# Altium schematic sheet WIFI_NVME.SchDoc
size B; SheetNumber: 10; SheetTotal: 11
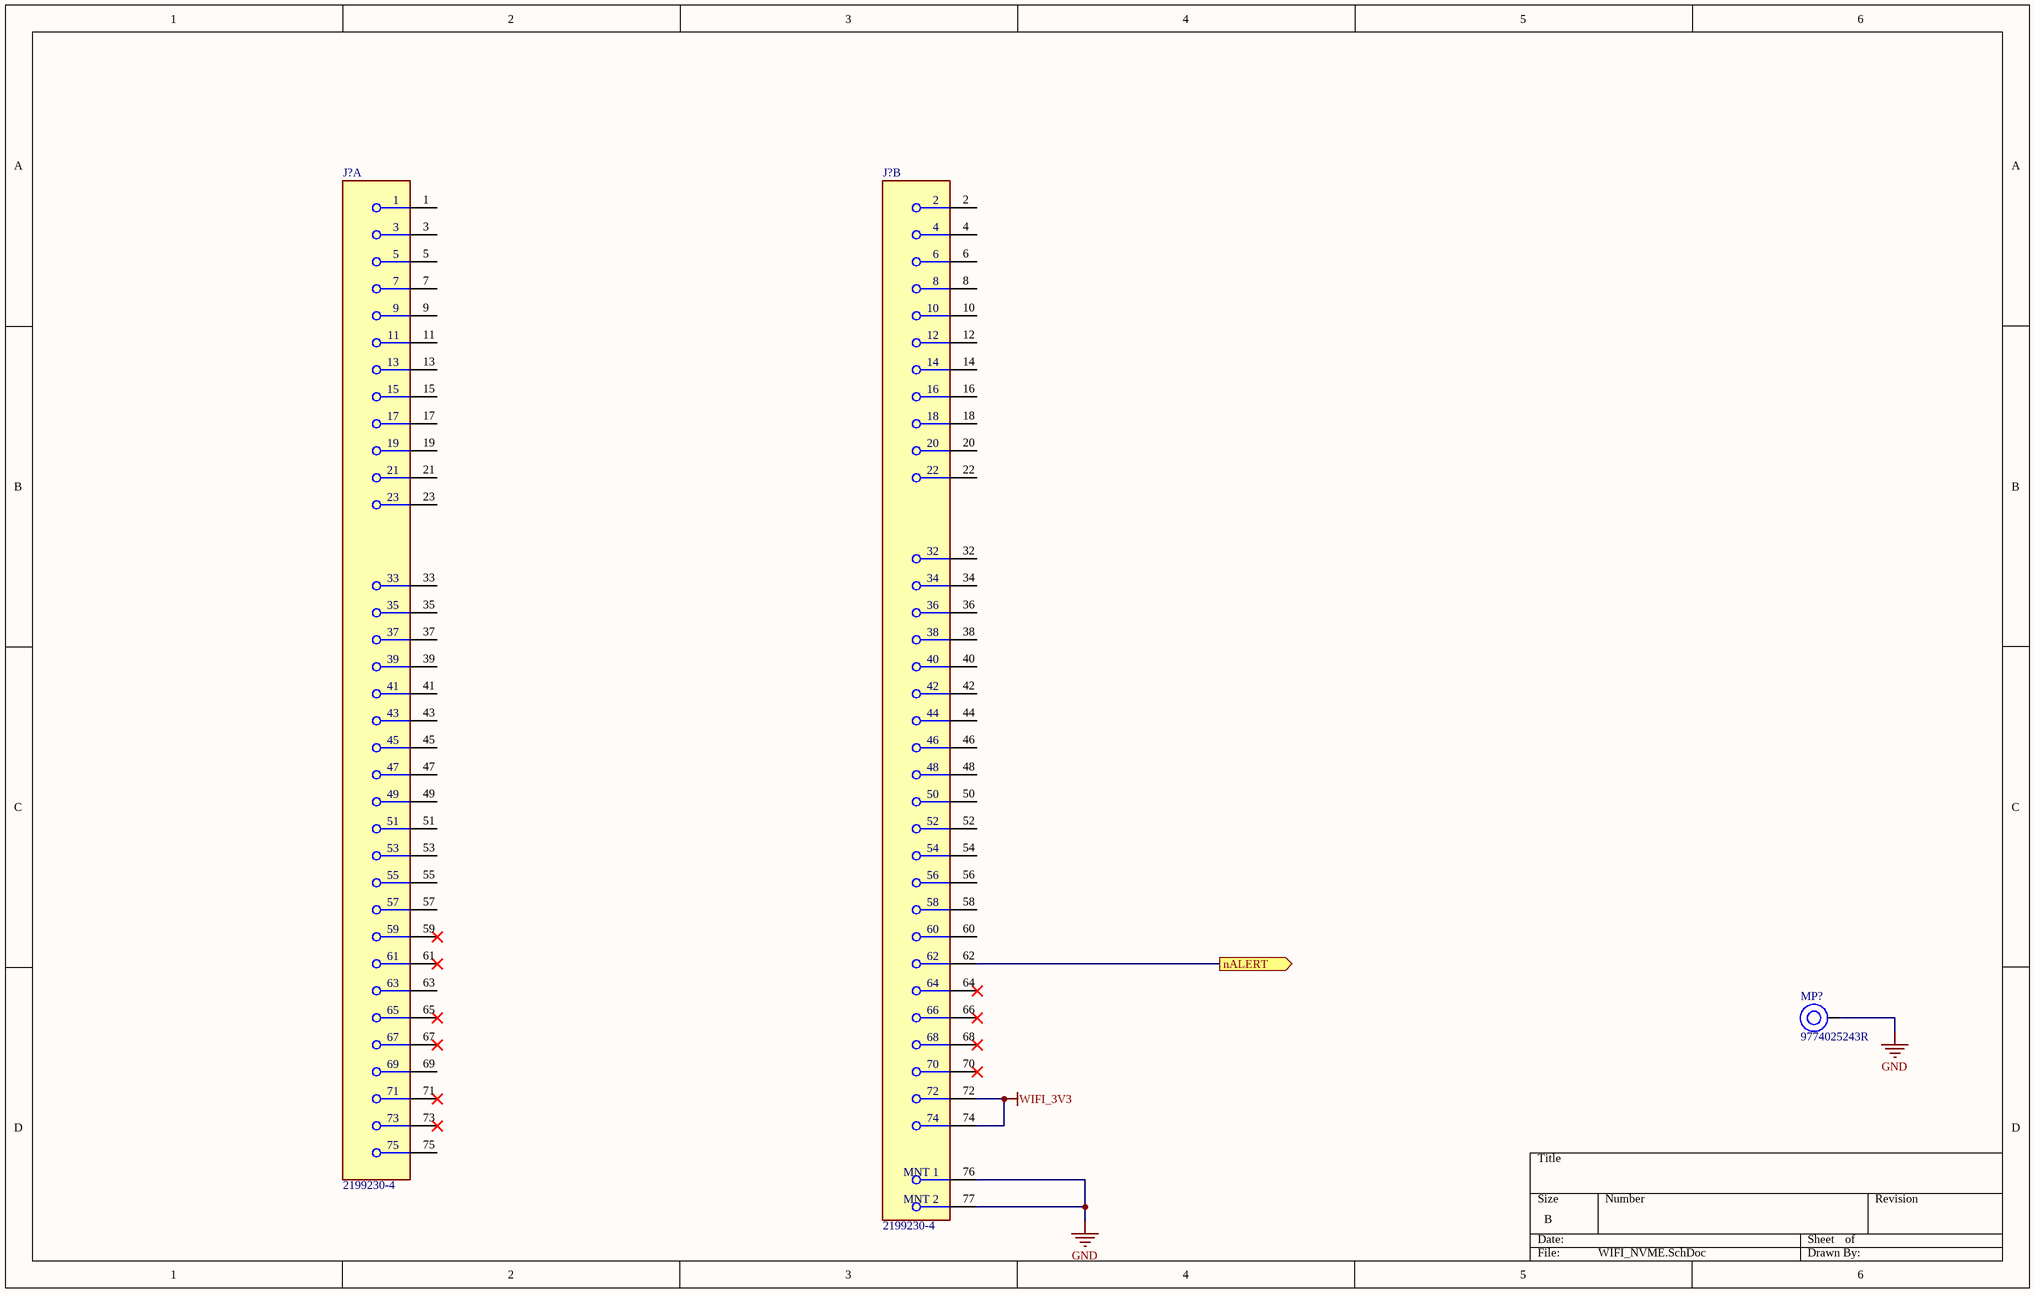
[diagram p0: WIFI_NVME.SchDoc]

## Parts
(Parts that share a designator on the sheet are numbered #1, #2 ... from top to bottom, then left to right.)
J?#1  2199230-4  [FP-2199230-4-MFG]  (part A of 2)
J?#2  2199230-4  [FP-2199230-4-MFG]  (part B of 2)
MP?  9774025243R  [9774025243]

## Ports
nALERT (out)

## Nets
GND: J?#2.76(MNT_1) J?#2.77(MNT_2) MP?.1
WIFI_3V3: J?#2.72 J?#2.74
nALERT: J?#2.62 ; port nALERT

Not connected (* = marked no-connect by the designer): J?#1 1 3 5 7 9 11 13 15 17 19 21 23 33 35 37 39 41 43 45 47 49 51 53 55 57 59* 61* 63 65* 67* 69 71* 73* 75; J?#2 2 4 6 8 10 12 14 16 18 20 22 32 34 36 38 40 42 44 46 48 50 52 54 56 58 60 64* 66* 68* 70*

## Library data of the parts
J?#1 J?#2 = CMP-03365-000002-1: CONN FEMALE 67POS 0.020 GOLD; Manufacturer: TE Connectivity; Conn Orientation: Right Angle; Pitch: 0.5mm; Number Of Contacts: 67; Voltage Rating: 50V; Is Female: yes; Current Rating: 0.5A; Lead Free: Yes; Temperature Range Low: -40°C; Device Class L3: unset; Package: 0; Manufacturer Part Number: 2199230-4; RoHS: TRUE; Digikey Description: CONN FEMALE 67POS 0.020 GOLD; Category: Conn; Device Class L1: Connectors; Temperature Range High: +80°C; ComponentLink2Description: Datasheet; ComponentLink2URL: https://www.te.com/commerce/DocumentDelivery/DDEController?Action=showdoc&DocId=Customer+Drawing%7F2199230%7FB3%7Fpdf%7FEnglish%7FENG_CD_2199230_B3.pdf%7F2199230-4; Mouser Description: PCI Express / PCI Connectors .5PITCH 4.2H KEY E EMBOSS NGFF MINICARD; Automotive: No; Conn Gender: Female; Height: 4.2mm; Device Class L2: Card Edge Connectors; Contact Material: Gold,Nickel; Number Of Rows: 2; Octopart: https://octopart.com/2199230-4-te+connectivity-46436156; Temperature: -40°C to +80°C
MP? = CMP-03913-59774857-1: 9774025243R Spacer Material: Steel, Tin-Plated Mounting: SMT Series: WA-SMST Thread D: M2; Outside Diameter: 4.3434mm; Threaded/Unthreaded: Threaded; Plating: Tin; REACH SVHC: Unknown; NexarPartId: 59774857; RoHS: Compliant; Material: Steel; Packaging: Tape and Reel; Max Operating Temperature: 150°C; Min Operating Temperature: -55°C; Length: 2.5mm; Height: 2.5mm